# EAGLE board 4x16MUX_3 (EAGLE 6.5.0), part 1 of 2
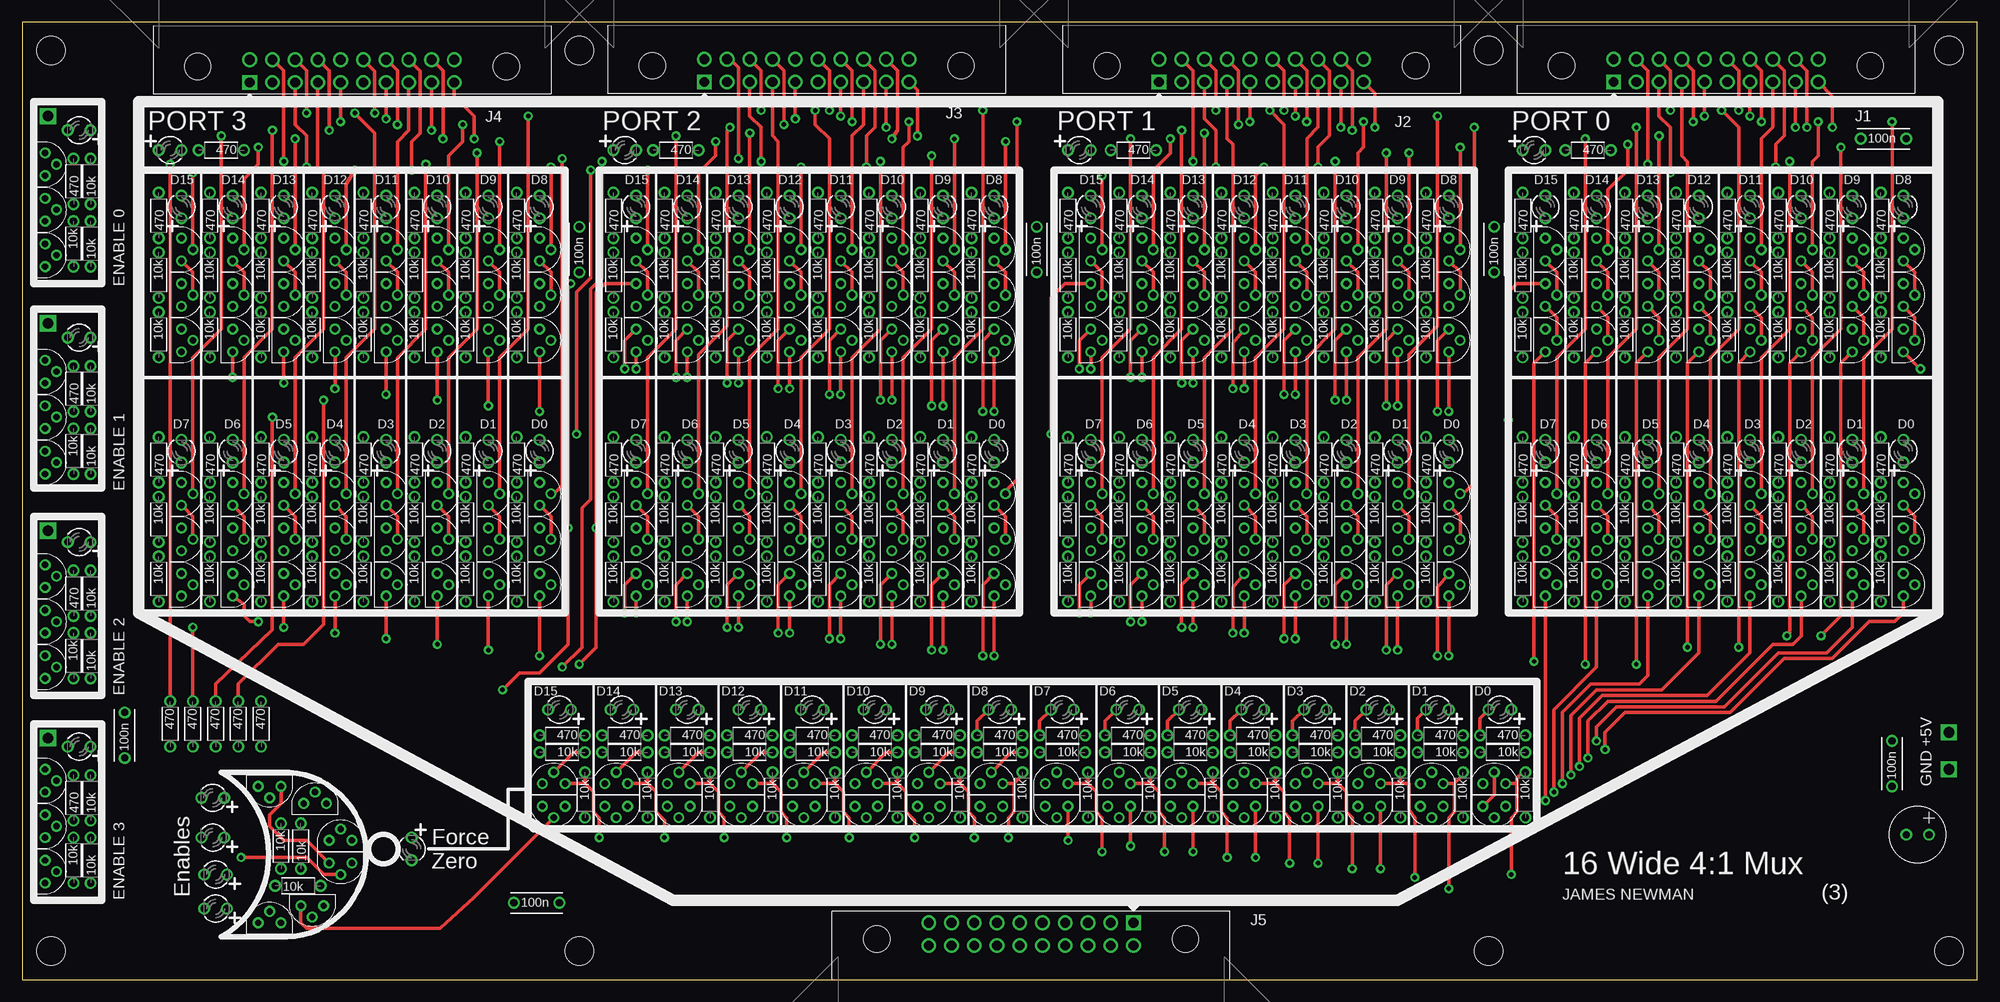
[diagram p14: board, top side]
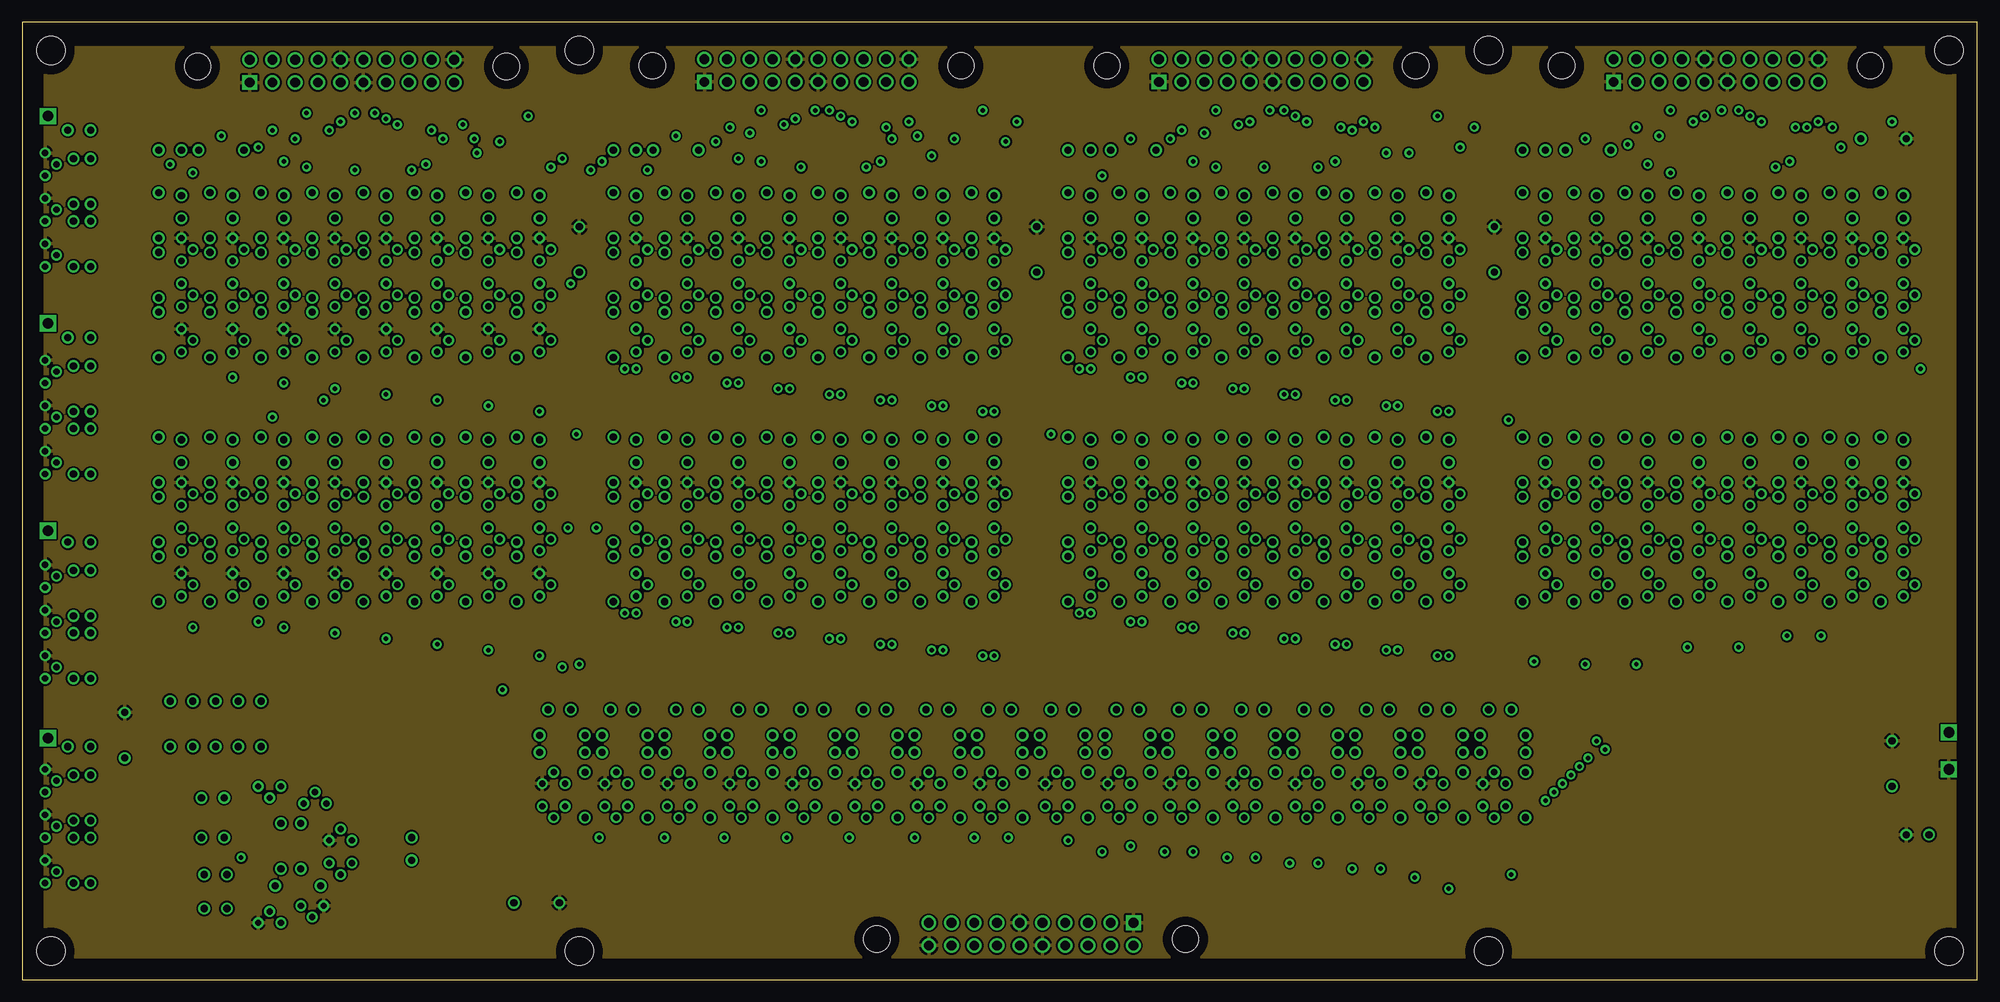
[diagram p15: board, inner layer Route2]
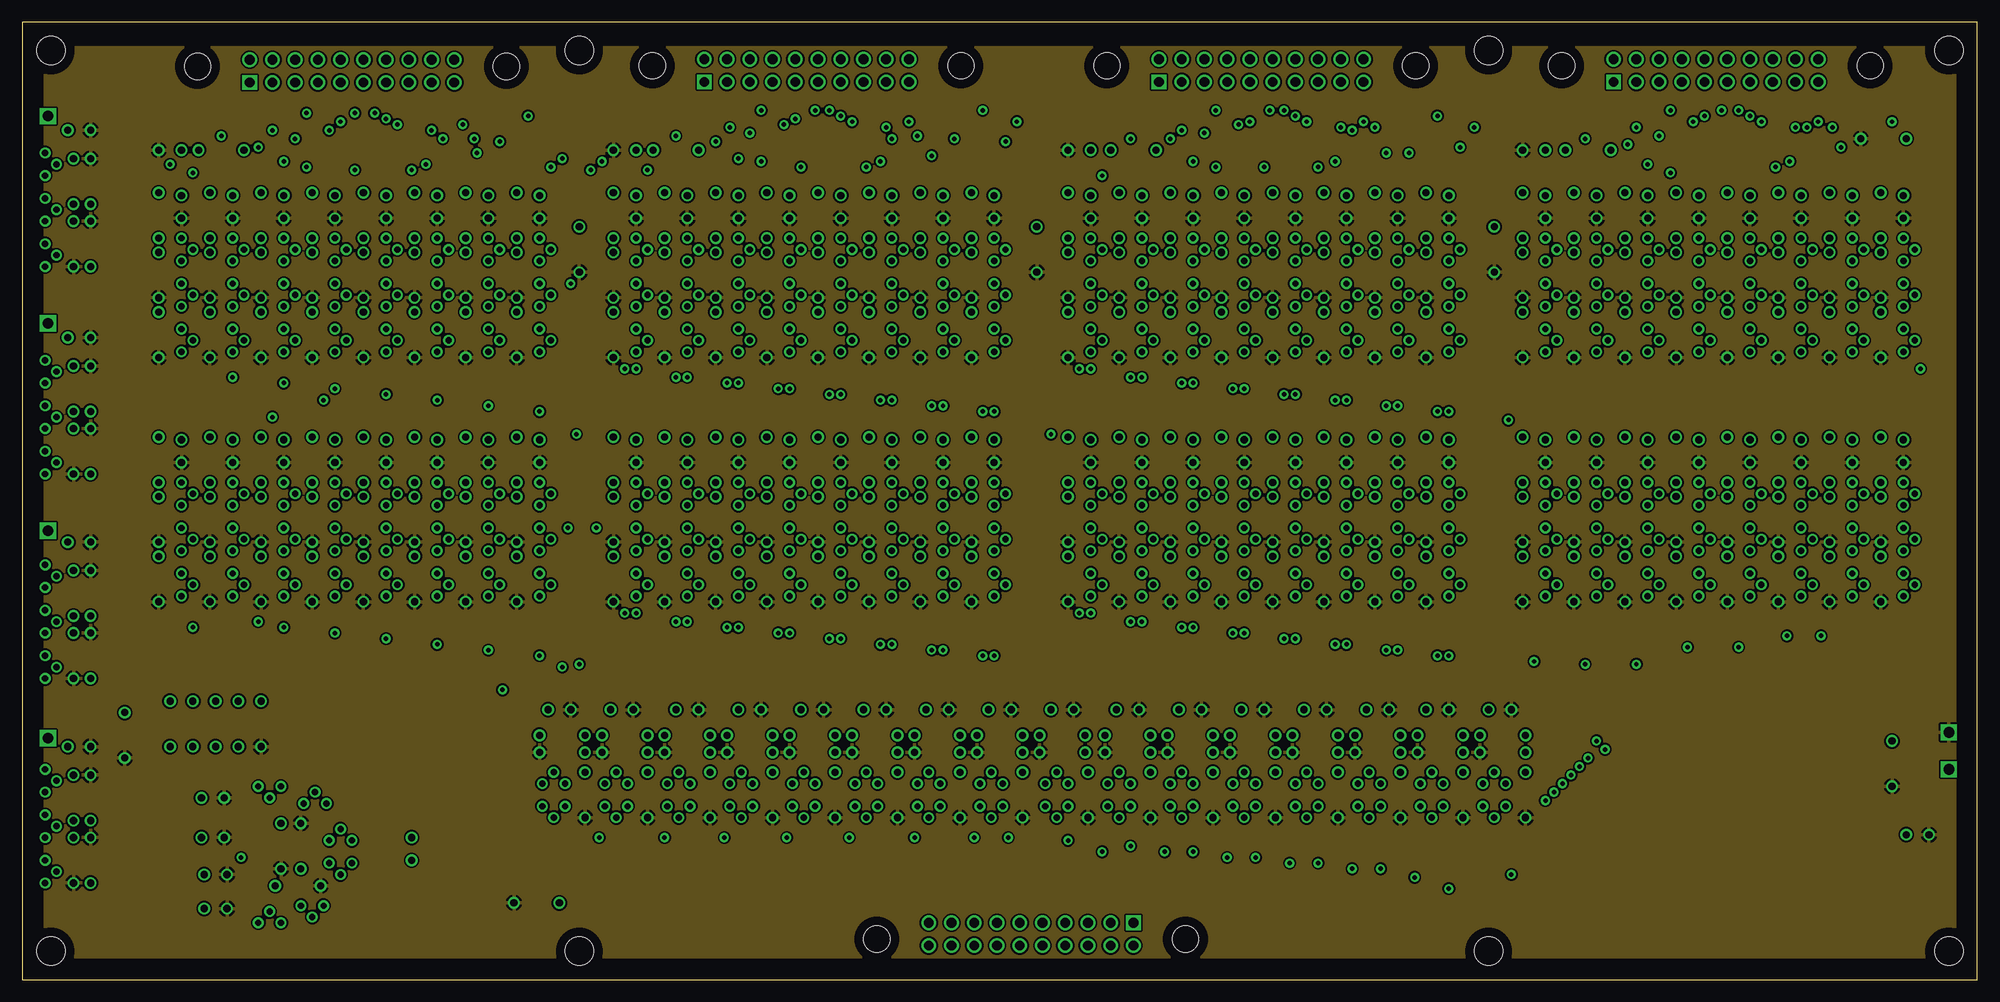
[diagram p16: board, inner layer Route3]
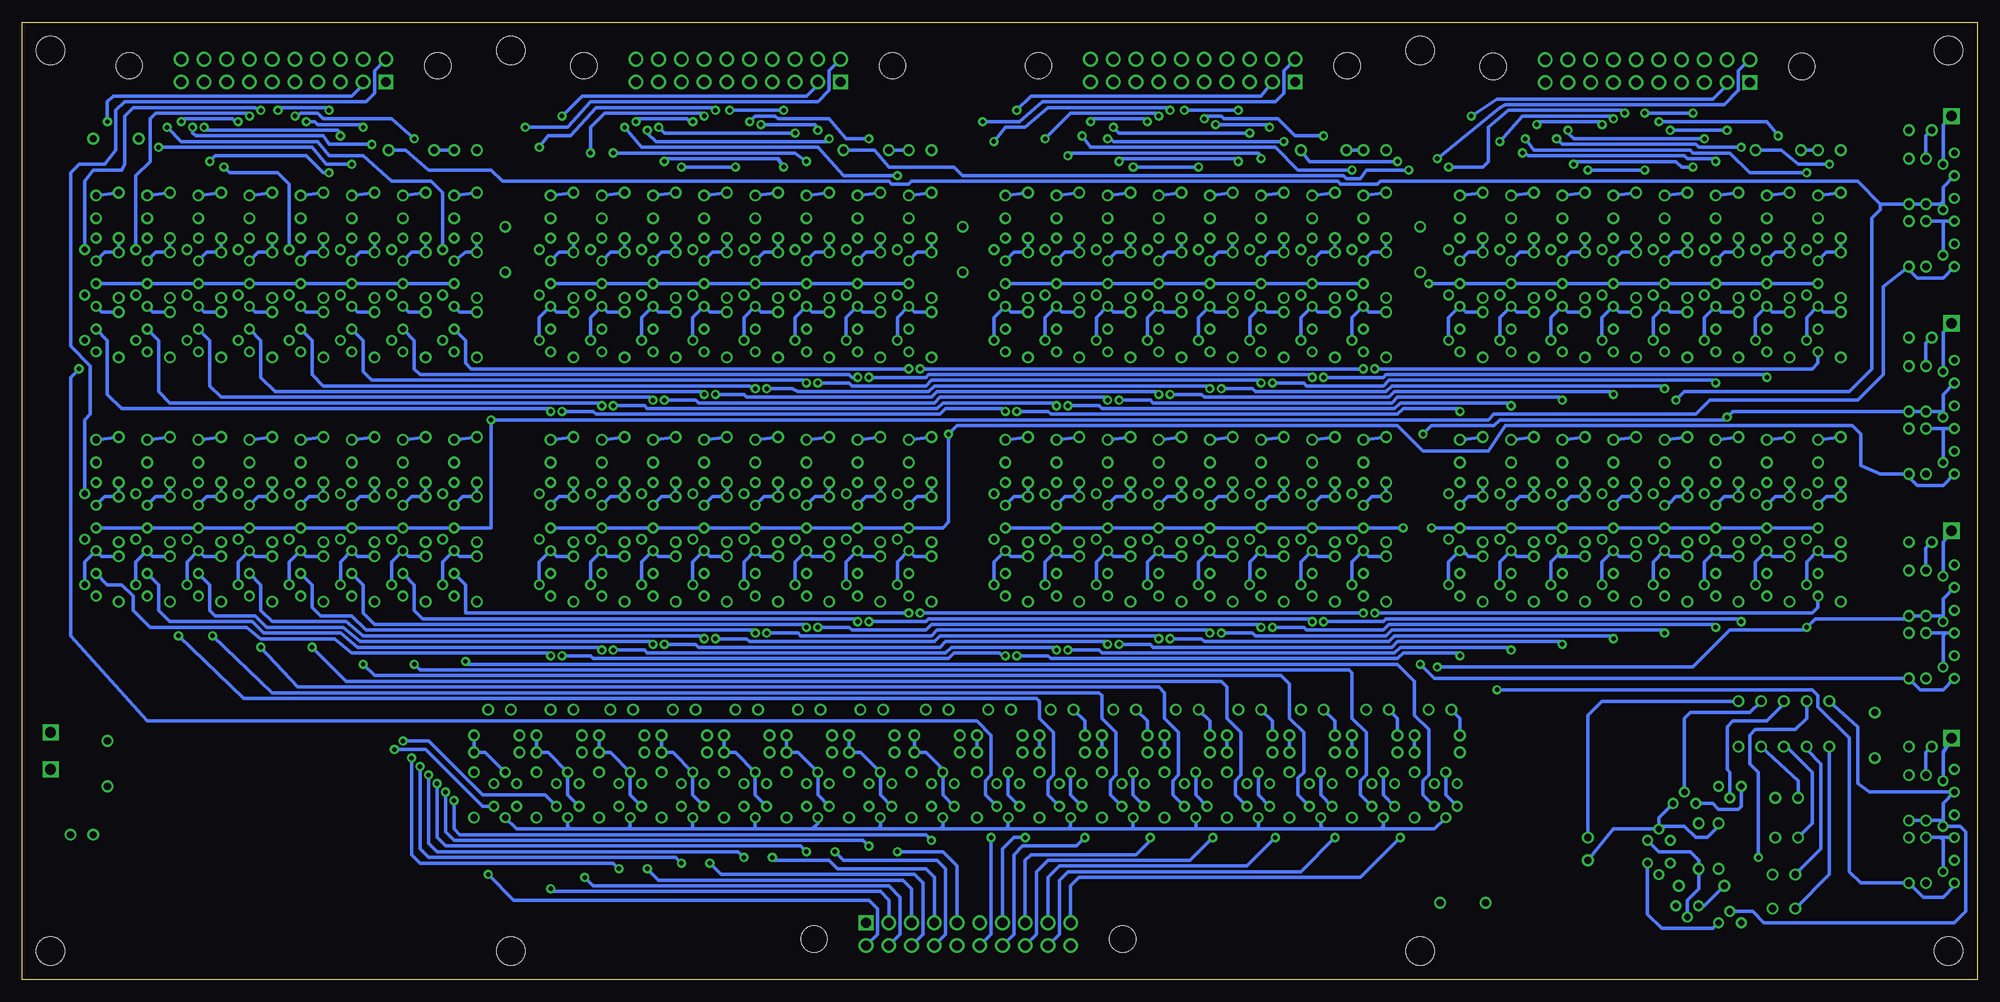
[diagram p17: board, bottom side, seen from below]

Size 218.42 x 106.98 mm. Coordinates in mm from the lower left corner, seen from the top.
Outline: 0,0 218.42,0 218.42,106.98 0,106.98 0,0
Copper layers (1*2+3*16): Top 0.035mm / dielectric 0.2mm / Route2 0.035mm / dielectric 1mm / Route3 0.035mm / dielectric 0.2mm / Bottom 0.035mm
Design rules "processor_rules_4layer": minimum track width 10mil, minimum drill 0.0236mm, track to track 8mil, track to pad 8mil, pad to pad 8mil, via to via 8mil, smd to smd 8mil, copper to edge 40mil, drill to drill 8mil, minimum pad ring 10mil, minimum via ring 8mil, stop-mask expansion 4mil, vias tented up to drill 0.7mm, thermal gap 10mil

## Footprints (pad centres in the part's own frame; a part is rotated, then mirrored left to right if it is on the bottom)
CAP_P2INCH = drill 0.8: 1 -2.54,0; 2 2.54,0
POLARISED_CAP_2P5_6P3MM = drill 0.8: A 1.27,0; K -1.27,0
LED3MM = drill 0.8: A -1.27,0; K 1.27,0
3M_HOLE = hole 3.2: 0,0
20_HDR_LOCKING_RA = drill 1.1 square: 1 -11.43,-1.27 | drill 1.1: 2 -11.43,1.27; 3 -8.89,-1.27; 4 -8.89,1.27; 5 -6.35,-1.27; 6 -6.35,1.27; 7 -3.81,-1.27; 8 -3.81,1.27; 9 -1.27,-1.27; 10 -1.27,1.27; 11 1.27,-1.27; 12 1.27,1.27; 13 3.81,-1.27; 14 3.81,1.27; 15 6.35,-1.27; 16 6.35,1.27; 17 8.89,-1.27; 18 8.89,1.27; 19 11.43,-1.27; 20 11.43,1.27 | hole 2.946: -17.247,0.533; 17.247,0.533
TO92-DGS = drill 0.7: D 0,1.27; G -1.27,0; S 0,-1.27
R_P2INCH = drill 0.8: 1 -2.54,0; 2 2.54,0
TEST_LOOP = drill 1.2 square: P$1 0,0

## Placement (x,y rotation side)
C1  100n  [CAP_P2INCH]  57.47,8.57 0 top
C2  100n  [CAP_P2INCH]  62.23,81.6 90 top
C3  100n  [CAP_P2INCH]  113.35,81.6 90 top
C4  100n  [CAP_P2INCH]  164.47,81.6 90 top
C5  100n  [CAP_P2INCH]  207.96,93.98 0 top
C6  100n  [CAP_P2INCH]  208.91,24.13 90 top
C7  100u  [POLARISED_CAP_2P5_6P3MM]  211.77,16.19 0 top
C8  100n  [CAP_P2INCH]  11.43,27.3 90 top
D1  L-1334SRT  [LED3MM]  210.19,59.05 90 top
D2  L-1334SRT  [LED3MM]  204.47,59.05 90 top
D3  L-1334SRT  [LED3MM]  198.75,59.05 90 top
D4  L-1334SRT  [LED3MM]  193.04,59.05 90 top
D5  L-1334SRT  [LED3MM]  187.32,59.05 90 top
D6  L-1334SRT  [LED3MM]  181.61,59.05 90 top
D7  L-1334SRT  [LED3MM]  175.9,59.05 90 top
D8  L-1334SRT  [LED3MM]  170.18,59.05 90 top
D9  L-1334SRT  [LED3MM]  210.19,86.36 90 top
D10  L-1334SRT  [LED3MM]  204.47,86.36 90 top
D11  L-1334SRT  [LED3MM]  198.75,86.36 90 top
D12  L-1334SRT  [LED3MM]  193.04,86.36 90 top
D13  L-1334SRT  [LED3MM]  187.32,86.36 90 top
D14  L-1334SRT  [LED3MM]  181.61,86.36 90 top
D15  L-1334SRT  [LED3MM]  175.9,86.36 90 top
D16  L-1334SRT  [LED3MM]  170.18,86.36 90 top
D17  L-1334SRT  [LED3MM]  159.38,59.05 90 top
D18  L-1334SRT  [LED3MM]  153.67,59.05 90 top
D19  L-1334SRT  [LED3MM]  147.96,59.05 90 top
D20  L-1334SRT  [LED3MM]  142.24,59.05 90 top
D21  L-1334SRT  [LED3MM]  136.53,59.05 90 top
D22  L-1334SRT  [LED3MM]  130.81,59.05 90 top
D23  L-1334SRT  [LED3MM]  125.09,59.05 90 top
D24  L-1334SRT  [LED3MM]  119.38,59.05 90 top
D25  L-1334SRT  [LED3MM]  159.38,86.36 90 top
D26  L-1334SRT  [LED3MM]  153.67,86.36 90 top
D27  L-1334SRT  [LED3MM]  147.96,86.36 90 top
D28  L-1334SRT  [LED3MM]  142.24,86.36 90 top
D29  L-1334SRT  [LED3MM]  136.53,86.36 90 top
D30  L-1334SRT  [LED3MM]  130.81,86.36 90 top
D31  L-1334SRT  [LED3MM]  125.09,86.36 90 top
D32  L-1334SRT  [LED3MM]  119.38,86.36 90 top
D33  L-1334SRT  [LED3MM]  108.58,59.05 90 top
D34  L-1334SRT  [LED3MM]  102.87,59.05 90 top
D35  L-1334SRT  [LED3MM]  97.16,59.05 90 top
D36  L-1334SRT  [LED3MM]  91.44,59.05 90 top
D37  L-1334SRT  [LED3MM]  85.72,59.05 90 top
D38  L-1334SRT  [LED3MM]  80.01,59.05 90 top
D39  L-1334SRT  [LED3MM]  74.3,59.05 90 top
D40  L-1334SRT  [LED3MM]  68.58,59.05 90 top
D41  L-1334SRT  [LED3MM]  108.58,86.36 90 top
D42  L-1334SRT  [LED3MM]  102.87,86.36 90 top
D43  L-1334SRT  [LED3MM]  97.16,86.36 90 top
D44  L-1334SRT  [LED3MM]  91.44,86.36 90 top
D45  L-1334SRT  [LED3MM]  85.72,86.36 90 top
D46  L-1334SRT  [LED3MM]  80.01,86.36 90 top
D47  L-1334SRT  [LED3MM]  74.3,86.36 90 top
D48  L-1334SRT  [LED3MM]  68.58,86.36 90 top
D49  L-1334SRT  [LED3MM]  57.78,59.05 90 top
D50  L-1334SRT  [LED3MM]  52.07,59.05 90 top
D51  L-1334SRT  [LED3MM]  46.35,59.05 90 top
D52  L-1334SRT  [LED3MM]  40.64,59.05 90 top
D53  L-1334SRT  [LED3MM]  34.92,59.05 90 top
D54  L-1334SRT  [LED3MM]  29.21,59.05 90 top
D55  L-1334SRT  [LED3MM]  23.5,59.05 90 top
D56  L-1334SRT  [LED3MM]  17.78,59.05 90 top
D57  L-1334SRT  [LED3MM]  57.78,86.36 90 top
D58  L-1334SRT  [LED3MM]  52.07,86.36 90 top
D59  L-1334SRT  [LED3MM]  46.35,86.36 90 top
D60  L-1334SRT  [LED3MM]  40.64,86.36 90 top
D61  L-1334SRT  [LED3MM]  34.92,86.36 90 top
D62  L-1334SRT  [LED3MM]  29.21,86.36 90 top
D63  L-1334SRT  [LED3MM]  23.5,86.36 90 top
D64  L-1334SRT  [LED3MM]  17.78,86.36 90 top
D65  L-1334SRT  [LED3MM]  6.35,94.93 180 top
D66  L-1334SRT  [LED3MM]  6.35,71.75 180 top
D67  L-1334SRT  [LED3MM]  6.35,48.9 180 top
D68  L-1334SRT  [LED3MM]  6.35,26.04 180 top
D69  L-1334SRT  [LED3MM]  165.1,30.16 180 top
D70  L-1334SRT  [LED3MM]  158.12,30.16 180 top
D71  L-1334SRT  [LED3MM]  151.45,30.16 180 top
D72  L-1334SRT  [LED3MM]  144.46,30.16 180 top
D73  L-1334SRT  [LED3MM]  137.48,30.16 180 top
D74  L-1334SRT  [LED3MM]  130.49,30.16 180 top
D75  L-1334SRT  [LED3MM]  123.51,30.16 180 top
D76  L-1334SRT  [LED3MM]  116.2,30.16 180 top
D77  L-1334SRT  [LED3MM]  109.22,30.16 180 top
D78  L-1334SRT  [LED3MM]  102.23,30.16 180 top
D79  L-1334SRT  [LED3MM]  95.25,30.16 180 top
D80  L-1334SRT  [LED3MM]  88.27,30.16 180 top
D81  L-1334SRT  [LED3MM]  81.28,30.16 180 top
D82  L-1334SRT  [LED3MM]  74.3,30.16 180 top
D83  L-1334SRT  [LED3MM]  66.99,30.16 180 top
D84  L-1334SRT  [LED3MM]  60.01,30.16 180 top
D85  L-1334SRT  [LED3MM]  168.91,92.71 0 top
D86  L-1334SRT  [LED3MM]  118.11,92.71 0 top
D87  L-1334SRT  [LED3MM]  67.31,92.71 0 top
D88  L-1334SRT  [LED3MM]  16.51,92.71 0 top
D89  L-1334SRT  [LED3MM]  21.27,20.32 180 top
D90  L-1334SRT  [LED3MM]  21.27,15.88 180 top
D91  L-1334SRT  [LED3MM]  21.59,11.75 180 top
D92  L-1334SRT  [LED3MM]  21.59,7.94 180 top
D93  L-1334SRT  [LED3MM]  43.5,14.61 270 top
H1  3M_MOUNT_HOLE  [3M_HOLE]  3.17,103.82 0 top
H2  3M_MOUNT_HOLE  [3M_HOLE]  3.17,3.17 0 top
H3  3M_MOUNT_HOLE  [3M_HOLE]  215.26,3.17 0 top
H4  3M_MOUNT_HOLE  [3M_HOLE]  215.26,103.82 0 top
H5  3M_MOUNT_HOLE  [3M_HOLE]  62.23,103.82 0 top
H6  3M_MOUNT_HOLE  [3M_HOLE]  163.83,103.82 0 top
H7  3M_MOUNT_HOLE  [3M_HOLE]  62.23,3.17 0 top
H8  3M_MOUNT_HOLE  [3M_HOLE]  163.83,3.17 0 top
J1  20_HDR_LOCKING_RA  [20_HDR_LOCKING_RA]  189.23,101.6 0 top
J2  20_HDR_LOCKING_RA  [20_HDR_LOCKING_RA]  138.43,101.6 0 top
J3  20_HDR_LOCKING_RA  [20_HDR_LOCKING_RA]  87.63,101.6 0 top
J4  20_HDR_LOCKING_RA  [20_HDR_LOCKING_RA]  36.83,101.54 0 top
J5  20_HDR_LOCKING_RA  [20_HDR_LOCKING_RA]  112.71,5.08 180 top
Q1  2N7000  [TO92-DGS]  210.19,54.29 180 top
Q2  2N7000  [TO92-DGS]  210.19,49.21 180 top
Q3  2N7000  [TO92-DGS]  204.47,54.29 180 top
Q4  2N7000  [TO92-DGS]  204.47,49.21 180 top
Q5  2N7000  [TO92-DGS]  198.75,54.29 180 top
Q6  2N7000  [TO92-DGS]  198.75,49.21 180 top
Q7  2N7000  [TO92-DGS]  193.04,54.29 180 top
Q8  2N7000  [TO92-DGS]  193.04,49.21 180 top
Q9  2N7000  [TO92-DGS]  187.32,54.29 180 top
Q10  2N7000  [TO92-DGS]  187.32,49.21 180 top
Q11  2N7000  [TO92-DGS]  181.61,54.29 180 top
Q12  2N7000  [TO92-DGS]  181.61,49.21 180 top
Q13  2N7000  [TO92-DGS]  175.9,54.29 180 top
Q14  2N7000  [TO92-DGS]  175.9,49.21 180 top
Q15  2N7000  [TO92-DGS]  170.18,54.29 180 top
Q16  2N7000  [TO92-DGS]  170.18,49.21 180 top
Q17  2N7000  [TO92-DGS]  210.19,81.6 180 top
Q18  2N7000  [TO92-DGS]  210.19,76.52 180 top
Q19  2N7000  [TO92-DGS]  204.47,81.6 180 top
Q20  2N7000  [TO92-DGS]  204.47,76.52 180 top
Q21  2N7000  [TO92-DGS]  198.75,81.6 180 top
Q22  2N7000  [TO92-DGS]  198.75,76.52 180 top
Q23  2N7000  [TO92-DGS]  193.04,81.6 180 top
Q24  2N7000  [TO92-DGS]  193.04,76.52 180 top
Q25  2N7000  [TO92-DGS]  187.32,81.6 180 top
Q26  2N7000  [TO92-DGS]  187.32,76.52 180 top
Q27  2N7000  [TO92-DGS]  181.61,81.6 180 top
Q28  2N7000  [TO92-DGS]  181.61,76.52 180 top
Q29  2N7000  [TO92-DGS]  175.9,81.6 180 top
Q30  2N7000  [TO92-DGS]  175.9,76.52 180 top
Q31  2N7000  [TO92-DGS]  170.18,81.6 180 top
Q32  2N7000  [TO92-DGS]  170.18,76.52 180 top
Q33  2N7000  [TO92-DGS]  159.38,54.29 180 top
Q34  2N7000  [TO92-DGS]  159.38,49.21 180 top
Q35  2N7000  [TO92-DGS]  153.67,54.29 180 top
Q36  2N7000  [TO92-DGS]  153.67,49.21 180 top
Q37  2N7000  [TO92-DGS]  147.96,54.29 180 top
Q38  2N7000  [TO92-DGS]  147.96,49.21 180 top
Q39  2N7000  [TO92-DGS]  142.24,54.29 180 top
Q40  2N7000  [TO92-DGS]  142.24,49.21 180 top
Q41  2N7000  [TO92-DGS]  136.53,54.29 180 top
Q42  2N7000  [TO92-DGS]  136.53,49.21 180 top
Q43  2N7000  [TO92-DGS]  130.81,54.29 180 top
Q44  2N7000  [TO92-DGS]  130.81,49.21 180 top
Q45  2N7000  [TO92-DGS]  125.09,54.29 180 top
Q46  2N7000  [TO92-DGS]  125.09,49.21 180 top
Q47  2N7000  [TO92-DGS]  119.38,54.29 180 top
Q48  2N7000  [TO92-DGS]  119.38,49.21 180 top
Q49  2N7000  [TO92-DGS]  159.38,81.6 180 top
Q50  2N7000  [TO92-DGS]  159.38,76.52 180 top
Q51  2N7000  [TO92-DGS]  153.67,81.6 180 top
Q52  2N7000  [TO92-DGS]  153.67,76.52 180 top
Q53  2N7000  [TO92-DGS]  147.96,81.6 180 top
Q54  2N7000  [TO92-DGS]  147.96,76.52 180 top
Q55  2N7000  [TO92-DGS]  142.24,81.6 180 top
Q56  2N7000  [TO92-DGS]  142.24,76.52 180 top
Q57  2N7000  [TO92-DGS]  136.53,81.6 180 top
Q58  2N7000  [TO92-DGS]  136.53,76.52 180 top
Q59  2N7000  [TO92-DGS]  130.81,81.6 180 top
Q60  2N7000  [TO92-DGS]  130.81,76.52 180 top
Q61  2N7000  [TO92-DGS]  125.09,81.6 180 top
Q62  2N7000  [TO92-DGS]  125.09,76.52 180 top
Q63  2N7000  [TO92-DGS]  119.38,81.6 180 top
Q64  2N7000  [TO92-DGS]  119.38,76.52 180 top
Q65  2N7000  [TO92-DGS]  108.58,54.29 180 top
Q66  2N7000  [TO92-DGS]  108.58,49.21 180 top
Q67  2N7000  [TO92-DGS]  102.87,54.29 180 top
Q68  2N7000  [TO92-DGS]  102.87,49.21 180 top
Q69  2N7000  [TO92-DGS]  97.16,54.29 180 top
Q70  2N7000  [TO92-DGS]  97.16,49.21 180 top
Q71  2N7000  [TO92-DGS]  91.44,54.29 180 top
Q72  2N7000  [TO92-DGS]  91.44,49.21 180 top
Q73  2N7000  [TO92-DGS]  85.72,54.29 180 top
Q74  2N7000  [TO92-DGS]  85.72,49.21 180 top
Q75  2N7000  [TO92-DGS]  80.01,54.29 180 top
Q76  2N7000  [TO92-DGS]  80.01,49.21 180 top
Q77  2N7000  [TO92-DGS]  74.3,54.29 180 top
Q78  2N7000  [TO92-DGS]  74.3,49.21 180 top
Q79  2N7000  [TO92-DGS]  68.58,54.29 180 top
Q80  2N7000  [TO92-DGS]  68.58,49.21 180 top
Q81  2N7000  [TO92-DGS]  108.58,81.6 180 top
Q82  2N7000  [TO92-DGS]  108.58,76.52 180 top
Q83  2N7000  [TO92-DGS]  102.87,81.6 180 top
Q84  2N7000  [TO92-DGS]  102.87,76.52 180 top
Q85  2N7000  [TO92-DGS]  97.16,81.6 180 top
Q86  2N7000  [TO92-DGS]  97.16,76.52 180 top
Q87  2N7000  [TO92-DGS]  91.44,81.6 180 top
Q88  2N7000  [TO92-DGS]  91.44,76.52 180 top
Q89  2N7000  [TO92-DGS]  85.72,81.6 180 top
Q90  2N7000  [TO92-DGS]  85.72,76.52 180 top
Q91  2N7000  [TO92-DGS]  80.01,81.6 180 top
Q92  2N7000  [TO92-DGS]  80.01,76.52 180 top
Q93  2N7000  [TO92-DGS]  74.3,81.6 180 top
Q94  2N7000  [TO92-DGS]  74.3,76.52 180 top
Q95  2N7000  [TO92-DGS]  68.58,81.6 180 top
Q96  2N7000  [TO92-DGS]  68.58,76.52 180 top
Q97  2N7000  [TO92-DGS]  57.78,54.29 180 top
Q98  2N7000  [TO92-DGS]  57.78,49.21 180 top
Q99  2N7000  [TO92-DGS]  52.07,54.29 180 top
Q100  2N7000  [TO92-DGS]  52.07,49.21 180 top
Q101  2N7000  [TO92-DGS]  46.35,54.29 180 top
Q102  2N7000  [TO92-DGS]  46.35,49.21 180 top
Q103  2N7000  [TO92-DGS]  40.64,54.29 180 top
Q104  2N7000  [TO92-DGS]  40.64,49.21 180 top
Q105  2N7000  [TO92-DGS]  34.92,54.29 180 top
Q106  2N7000  [TO92-DGS]  34.92,49.21 180 top
Q107  2N7000  [TO92-DGS]  29.21,54.29 180 top
Q108  2N7000  [TO92-DGS]  29.21,49.21 180 top
Q109  2N7000  [TO92-DGS]  23.5,54.29 180 top
Q110  2N7000  [TO92-DGS]  23.5,49.21 180 top
Q111  2N7000  [TO92-DGS]  17.78,54.29 180 top
Q112  2N7000  [TO92-DGS]  17.78,49.21 180 top
Q113  2N7000  [TO92-DGS]  57.78,81.6 180 top
Q114  2N7000  [TO92-DGS]  57.78,76.52 180 top
Q115  2N7000  [TO92-DGS]  52.07,81.6 180 top
Q116  2N7000  [TO92-DGS]  52.07,76.52 180 top
Q117  2N7000  [TO92-DGS]  46.35,81.6 180 top
Q118  2N7000  [TO92-DGS]  46.35,76.52 180 top
Q119  2N7000  [TO92-DGS]  40.64,81.6 180 top
Q120  2N7000  [TO92-DGS]  40.64,76.52 180 top
Q121  2N7000  [TO92-DGS]  34.92,81.6 180 top
Q122  2N7000  [TO92-DGS]  34.92,76.52 180 top
Q123  2N7000  [TO92-DGS]  29.21,81.6 180 top
Q124  2N7000  [TO92-DGS]  29.21,76.52 180 top
Q125  2N7000  [TO92-DGS]  23.5,81.6 180 top
Q126  2N7000  [TO92-DGS]  23.5,76.52 180 top
Q127  2N7000  [TO92-DGS]  17.78,81.6 180 top
Q128  2N7000  [TO92-DGS]  17.78,76.52 180 top
Q129  2N7000  [TO92-DGS]  2.54,91.12 180 top
Q130  2N7000  [TO92-DGS]  2.54,86.04 180 top
Q131  2N7000  [TO92-DGS]  2.54,80.96 180 top
Q132  2N7000  [TO92-DGS]  2.54,67.94 180 top
Q133  2N7000  [TO92-DGS]  2.54,62.87 180 top
Q134  2N7000  [TO92-DGS]  2.54,57.78 180 top
Q135  2N7000  [TO92-DGS]  2.54,45.09 180 top
Q136  2N7000  [TO92-DGS]  2.54,40.01 180 top
Q137  2N7000  [TO92-DGS]  2.54,34.92 180 top
Q138  2N7000  [TO92-DGS]  2.54,22.23 180 top
Q139  2N7000  [TO92-DGS]  2.54,17.14 180 top
Q140  2N7000  [TO92-DGS]  2.54,12.06 180 top
Q141  2N7000  [TO92-DGS]  210.19,44.13 180 top
Q142  2N7000  [TO92-DGS]  164.47,21.91 270 top
Q143  2N7000  [TO92-DGS]  159.38,44.13 180 top
Q144  2N7000  [TO92-DGS]  108.58,44.13 180 top
Q145  2N7000  [TO92-DGS]  57.78,44.13 180 top
Q146  2N7000  [TO92-DGS]  204.47,44.13 180 top
Q147  2N7000  [TO92-DGS]  157.48,21.91 270 top
Q148  2N7000  [TO92-DGS]  153.67,44.13 180 top
Q149  2N7000  [TO92-DGS]  102.87,44.13 180 top
Q150  2N7000  [TO92-DGS]  52.07,44.13 180 top
Q151  2N7000  [TO92-DGS]  198.75,44.13 180 top
Q152  2N7000  [TO92-DGS]  150.5,21.91 270 top
Q153  2N7000  [TO92-DGS]  147.96,44.13 180 top
Q154  2N7000  [TO92-DGS]  97.16,44.13 180 top
Q155  2N7000  [TO92-DGS]  46.35,44.13 180 top
Q156  2N7000  [TO92-DGS]  193.04,44.13 180 top
Q157  2N7000  [TO92-DGS]  143.51,21.91 270 top
Q158  2N7000  [TO92-DGS]  142.24,44.13 180 top
Q159  2N7000  [TO92-DGS]  91.44,44.13 180 top
Q160  2N7000  [TO92-DGS]  40.64,44.13 180 top
Q161  2N7000  [TO92-DGS]  187.32,44.13 180 top
Q162  2N7000  [TO92-DGS]  136.53,21.91 270 top
Q163  2N7000  [TO92-DGS]  136.53,44.13 180 top
Q164  2N7000  [TO92-DGS]  85.72,44.13 180 top
Q165  2N7000  [TO92-DGS]  34.92,44.13 180 top
Q166  2N7000  [TO92-DGS]  181.61,44.13 180 top
Q167  2N7000  [TO92-DGS]  129.54,21.91 270 top
Q168  2N7000  [TO92-DGS]  130.81,44.13 180 top
Q169  2N7000  [TO92-DGS]  80.01,44.13 180 top
Q170  2N7000  [TO92-DGS]  29.21,44.13 180 top
Q171  2N7000  [TO92-DGS]  175.9,44.13 180 top
Q172  2N7000  [TO92-DGS]  122.56,21.91 270 top
Q173  2N7000  [TO92-DGS]  125.09,44.13 180 top
Q174  2N7000  [TO92-DGS]  74.3,44.13 180 top
Q175  2N7000  [TO92-DGS]  23.5,44.13 180 top
Q176  2N7000  [TO92-DGS]  170.18,44.13 180 top
Q177  2N7000  [TO92-DGS]  115.57,21.91 270 top
Q178  2N7000  [TO92-DGS]  119.38,44.13 180 top
Q179  2N7000  [TO92-DGS]  68.58,44.13 180 top
Q180  2N7000  [TO92-DGS]  17.78,44.13 180 top
Q181  2N7000  [TO92-DGS]  210.19,71.44 180 top
Q182  2N7000  [TO92-DGS]  108.27,21.91 270 top
Q183  2N7000  [TO92-DGS]  159.38,71.44 180 top
Q184  2N7000  [TO92-DGS]  108.58,71.44 180 top
Q185  2N7000  [TO92-DGS]  57.78,71.44 180 top
Q186  2N7000  [TO92-DGS]  204.47,71.44 180 top
Q187  2N7000  [TO92-DGS]  101.28,21.91 270 top
Q188  2N7000  [TO92-DGS]  153.67,71.44 180 top
Q189  2N7000  [TO92-DGS]  102.87,71.44 180 top
Q190  2N7000  [TO92-DGS]  52.07,71.44 180 top
Q191  2N7000  [TO92-DGS]  198.75,71.44 180 top
Q192  2N7000  [TO92-DGS]  94.3,21.91 270 top
Q193  2N7000  [TO92-DGS]  147.96,71.44 180 top
Q194  2N7000  [TO92-DGS]  97.16,71.44 180 top
Q195  2N7000  [TO92-DGS]  46.35,71.44 180 top
Q196  2N7000  [TO92-DGS]  193.04,71.44 180 top
Q197  2N7000  [TO92-DGS]  87.31,21.91 270 top
Q198  2N7000  [TO92-DGS]  142.24,71.44 180 top
Q199  2N7000  [TO92-DGS]  91.44,71.44 180 top
Q200  2N7000  [TO92-DGS]  40.64,71.44 180 top
Q201  2N7000  [TO92-DGS]  187.32,71.44 180 top
Q202  2N7000  [TO92-DGS]  80.33,21.91 270 top
Q203  2N7000  [TO92-DGS]  136.53,71.44 180 top
Q204  2N7000  [TO92-DGS]  85.72,71.44 180 top
Q205  2N7000  [TO92-DGS]  34.92,71.44 180 top
Q206  2N7000  [TO92-DGS]  181.61,71.44 180 top
Q207  2N7000  [TO92-DGS]  73.34,21.91 270 top
Q208  2N7000  [TO92-DGS]  130.81,71.44 180 top
Q209  2N7000  [TO92-DGS]  80.01,71.44 180 top
Q210  2N7000  [TO92-DGS]  29.21,71.44 180 top
Q211  2N7000  [TO92-DGS]  175.9,71.44 180 top
Q212  2N7000  [TO92-DGS]  66.36,21.91 270 top
Q213  2N7000  [TO92-DGS]  125.09,71.44 180 top
Q214  2N7000  [TO92-DGS]  74.3,71.44 180 top
Q215  2N7000  [TO92-DGS]  23.5,71.44 180 top
Q216  2N7000  [TO92-DGS]  170.18,71.44 180 top
Q217  2N7000  [TO92-DGS]  59.37,21.91 270 top
Q218  2N7000  [TO92-DGS]  119.38,71.44 180 top
Q219  2N7000  [TO92-DGS]  68.58,71.44 180 top
Q220  2N7000  [TO92-DGS]  17.78,71.44 180 top
Q221  2N7000  [TO92-DGS]  164.47,19.37 90 top
Q222  2N7000  [TO92-DGS]  157.48,19.37 90 top
Q223  2N7000  [TO92-DGS]  150.5,19.37 90 top
Q224  2N7000  [TO92-DGS]  143.51,19.37 90 top
Q225  2N7000  [TO92-DGS]  136.53,19.37 90 top
Q226  2N7000  [TO92-DGS]  129.54,19.37 90 top
Q227  2N7000  [TO92-DGS]  122.56,19.37 90 top
Q228  2N7000  [TO92-DGS]  115.57,19.37 90 top
Q229  2N7000  [TO92-DGS]  108.27,19.37 90 top
Q230  2N7000  [TO92-DGS]  101.28,19.37 90 top
Q231  2N7000  [TO92-DGS]  94.3,19.37 90 top
Q232  2N7000  [TO92-DGS]  87.31,19.37 90 top
Q233  2N7000  [TO92-DGS]  80.33,19.37 90 top
Q234  2N7000  [TO92-DGS]  73.34,19.37 90 top
Q235  2N7000  [TO92-DGS]  66.36,19.37 90 top
Q236  2N7000  [TO92-DGS]  59.37,19.37 90 top
Q237  2N7000  [TO92-DGS]  27.62,6.35 270 top
Q238  2N7000  [TO92-DGS]  32.7,19.68 270 top
Q239  2N7000  [TO92-DGS]  27.62,21.59 90 top
Q240  2N7000  [TO92-DGS]  35.56,13.02 90 top
Q241  2N7000  [TO92-DGS]  35.56,15.56 270 top
Q242  2N7000  [TO92-DGS]  32.38,8.26 90 top
R1  10k  [R_P2INCH]  207.65,51.44 270 top
R2  470  [R_P2INCH]  207.65,58.1 90 top
R3  10k  [R_P2INCH]  201.93,51.44 270 top
R4  470  [R_P2INCH]  201.93,58.1 90 top
R5  10k  [R_P2INCH]  196.22,51.44 270 top
R6  470  [R_P2INCH]  196.22,58.1 90 top
R7  10k  [R_P2INCH]  190.5,51.44 270 top
R8  470  [R_P2INCH]  190.5,58.1 90 top
R9  10k  [R_P2INCH]  184.78,51.44 270 top
R10  470  [R_P2INCH]  184.78,58.1 90 top
R11  10k  [R_P2INCH]  179.07,51.44 270 top
R12  470  [R_P2INCH]  179.07,58.1 90 top
R13  10k  [R_P2INCH]  173.35,51.44 270 top
R14  470  [R_P2INCH]  173.35,58.1 90 top
R15  10k  [R_P2INCH]  167.64,51.44 270 top
R16  470  [R_P2INCH]  167.64,58.1 90 top
R17  10k  [R_P2INCH]  207.65,78.74 270 top
R18  470  [R_P2INCH]  207.65,85.41 90 top
R19  10k  [R_P2INCH]  201.93,78.74 270 top
R20  470  [R_P2INCH]  201.93,85.41 90 top
R21  10k  [R_P2INCH]  196.22,78.74 270 top
R22  470  [R_P2INCH]  196.22,85.41 90 top
R23  10k  [R_P2INCH]  190.5,78.74 270 top
R24  470  [R_P2INCH]  190.5,85.41 90 top
R25  10k  [R_P2INCH]  184.78,78.74 270 top
R26  470  [R_P2INCH]  184.78,85.41 90 top
R27  10k  [R_P2INCH]  179.07,78.74 270 top
R28  470  [R_P2INCH]  179.07,85.41 90 top
R29  10k  [R_P2INCH]  173.35,78.74 270 top
R30  470  [R_P2INCH]  173.35,85.41 90 top
R31  10k  [R_P2INCH]  167.64,78.74 270 top
R32  470  [R_P2INCH]  167.64,85.41 90 top
R33  10k  [R_P2INCH]  156.84,51.44 270 top
R34  470  [R_P2INCH]  156.84,58.1 90 top
R35  10k  [R_P2INCH]  151.13,51.44 270 top
R36  470  [R_P2INCH]  151.13,58.1 90 top
R37  10k  [R_P2INCH]  145.41,51.44 270 top
R38  470  [R_P2INCH]  145.41,58.1 90 top
R39  10k  [R_P2INCH]  139.7,51.44 270 top
R40  470  [R_P2INCH]  139.7,58.1 90 top
R41  10k  [R_P2INCH]  133.99,51.44 270 top
R42  470  [R_P2INCH]  133.99,58.1 90 top
R43  10k  [R_P2INCH]  128.27,51.44 270 top
R44  470  [R_P2INCH]  128.27,58.1 90 top
R45  10k  [R_P2INCH]  122.56,51.44 270 top
R46  470  [R_P2INCH]  122.56,58.1 90 top
R47  10k  [R_P2INCH]  116.84,51.44 270 top
R48  470  [R_P2INCH]  116.84,58.1 90 top
R49  10k  [R_P2INCH]  156.84,78.74 270 top
R50  470  [R_P2INCH]  156.84,85.41 90 top
R51  10k  [R_P2INCH]  151.13,78.74 270 top
R52  470  [R_P2INCH]  151.13,85.41 90 top
R53  10k  [R_P2INCH]  145.41,78.74 270 top
R54  470  [R_P2INCH]  145.41,85.41 90 top
R55  10k  [R_P2INCH]  139.7,78.74 270 top
R56  470  [R_P2INCH]  139.7,85.41 90 top
R57  10k  [R_P2INCH]  133.99,78.74 270 top
R58  470  [R_P2INCH]  133.99,85.41 90 top
R59  10k  [R_P2INCH]  128.27,78.74 270 top
R60  470  [R_P2INCH]  128.27,85.41 90 top
R61  10k  [R_P2INCH]  122.56,78.74 270 top
R62  470  [R_P2INCH]  122.56,85.41 90 top
R63  10k  [R_P2INCH]  116.84,78.74 270 top
R64  470  [R_P2INCH]  116.84,85.41 90 top
R65  10k  [R_P2INCH]  106.05,51.44 270 top
R66  470  [R_P2INCH]  106.05,58.1 90 top
R67  10k  [R_P2INCH]  100.33,51.44 270 top
R68  470  [R_P2INCH]  100.33,58.1 90 top
R69  10k  [R_P2INCH]  94.61,51.44 270 top
R70  470  [R_P2INCH]  94.61,58.1 90 top
R71  10k  [R_P2INCH]  88.9,51.44 270 top
R72  470  [R_P2INCH]  88.9,58.1 90 top
R73  10k  [R_P2INCH]  83.19,51.44 270 top
R74  470  [R_P2INCH]  83.19,58.1 90 top
R75  10k  [R_P2INCH]  77.47,51.44 270 top
R76  470  [R_P2INCH]  77.47,58.1 90 top
R77  10k  [R_P2INCH]  71.75,51.44 270 top
R78  470  [R_P2INCH]  71.75,58.1 90 top
R79  10k  [R_P2INCH]  66.04,51.44 270 top
R80  470  [R_P2INCH]  66.04,58.1 90 top
R81  10k  [R_P2INCH]  106.05,78.74 270 top
R82  470  [R_P2INCH]  106.05,85.41 90 top
R83  10k  [R_P2INCH]  100.33,78.74 270 top
R84  470  [R_P2INCH]  100.33,85.41 90 top
R85  10k  [R_P2INCH]  94.61,78.74 270 top
R86  470  [R_P2INCH]  94.61,85.41 90 top
R87  10k  [R_P2INCH]  88.9,78.74 270 top
R88  470  [R_P2INCH]  88.9,85.41 90 top
R89  10k  [R_P2INCH]  83.19,78.74 270 top
R90  470  [R_P2INCH]  83.19,85.41 90 top
R91  10k  [R_P2INCH]  77.47,78.74 270 top
R92  470  [R_P2INCH]  77.47,85.41 90 top
R93  10k  [R_P2INCH]  71.75,78.74 270 top
R94  470  [R_P2INCH]  71.75,85.41 90 top
R95  10k  [R_P2INCH]  66.04,78.74 270 top
R96  470  [R_P2INCH]  66.04,85.41 90 top
R97  10k  [R_P2INCH]  55.24,51.44 270 top
R98  470  [R_P2INCH]  55.24,58.1 90 top
R99  10k  [R_P2INCH]  49.53,51.44 270 top
R100  470  [R_P2INCH]  49.53,58.1 90 top
R101  10k  [R_P2INCH]  43.81,51.44 270 top
R102  470  [R_P2INCH]  43.81,58.1 90 top
R103  10k  [R_P2INCH]  38.1,51.44 270 top
R104  470  [R_P2INCH]  38.1,58.1 90 top
R105  10k  [R_P2INCH]  32.38,51.44 270 top
R106  470  [R_P2INCH]  32.38,58.1 90 top
R107  10k  [R_P2INCH]  26.67,51.44 270 top
R108  470  [R_P2INCH]  26.67,58.1 90 top
R109  10k  [R_P2INCH]  20.95,51.44 270 top
R110  470  [R_P2INCH]  20.95,58.1 90 top
R111  10k  [R_P2INCH]  15.24,51.44 270 top
R112  470  [R_P2INCH]  15.24,58.1 90 top
R113  10k  [R_P2INCH]  55.24,78.74 270 top
R114  470  [R_P2INCH]  55.24,85.41 90 top
R115  10k  [R_P2INCH]  49.53,78.74 270 top
R116  470  [R_P2INCH]  49.53,85.41 90 top
R117  10k  [R_P2INCH]  43.81,78.74 270 top
R118  470  [R_P2INCH]  43.81,85.41 90 top
R119  10k  [R_P2INCH]  38.1,78.74 270 top
R120  470  [R_P2INCH]  38.1,85.41 90 top
R121  10k  [R_P2INCH]  32.38,78.74 270 top
R122  470  [R_P2INCH]  32.38,85.41 90 top
R123  10k  [R_P2INCH]  26.67,78.74 270 top
R124  470  [R_P2INCH]  26.67,85.41 90 top
R125  10k  [R_P2INCH]  20.95,78.74 270 top
R126  470  [R_P2INCH]  20.95,85.41 90 top
R127  10k  [R_P2INCH]  15.24,78.74 270 top
R128  470  [R_P2INCH]  15.24,85.41 90 top
R129  10k  [R_P2INCH]  7.62,89.22 90 top
R130  470  [R_P2INCH]  5.71,89.22 90 top
R131  10k  [R_P2INCH]  5.71,82.23 270 top
R132  10k  [R_P2INCH]  7.62,82.23 90 top
R133  10k  [R_P2INCH]  7.62,66.04 90 top
R134  470  [R_P2INCH]  5.71,66.04 90 top
R135  10k  [R_P2INCH]  5.71,59.05 270 top
R136  10k  [R_P2INCH]  7.62,59.05 90 top
R137  10k  [R_P2INCH]  7.62,43.18 90 top
R138  470  [R_P2INCH]  5.71,43.18 90 top
R139  10k  [R_P2INCH]  5.71,36.2 270 top
R140  10k  [R_P2INCH]  7.62,36.2 90 top
R141  10k  [R_P2INCH]  7.62,20.32 90 top
R142  470  [R_P2INCH]  5.71,20.32 90 top
R143  10k  [R_P2INCH]  5.71,13.34 270 top
R144  10k  [R_P2INCH]  7.62,13.34 90 top
R145  10k  [R_P2INCH]  165.42,25.4 180 top
R146  470  [R_P2INCH]  165.42,27.3 180 top
R147  10k  [R_P2INCH]  158.43,25.4 180 top
R148  470  [R_P2INCH]  158.43,27.3 180 top
R149  10k  [R_P2INCH]  151.45,25.4 180 top
R150  470  [R_P2INCH]  151.45,27.3 180 top
R151  10k  [R_P2INCH]  144.46,25.4 180 top
R152  470  [R_P2INCH]  144.46,27.3 180 top
R153  10k  [R_P2INCH]  137.48,25.4 180 top
R154  470  [R_P2INCH]  137.48,27.3 180 top
R155  10k  [R_P2INCH]  130.49,25.4 180 top
R156  470  [R_P2INCH]  130.49,27.3 180 top
R157  10k  [R_P2INCH]  123.51,25.4 180 top
R158  470  [R_P2INCH]  123.51,27.3 180 top
R159  10k  [R_P2INCH]  116.2,25.4 180 top
R160  470  [R_P2INCH]  116.2,27.3 180 top
R161  10k  [R_P2INCH]  109.22,25.4 180 top
R162  470  [R_P2INCH]  109.22,27.3 180 top
R163  10k  [R_P2INCH]  102.23,25.4 180 top
R164  470  [R_P2INCH]  102.23,27.3 180 top
R165  10k  [R_P2INCH]  95.25,25.4 180 top
R166  470  [R_P2INCH]  95.25,27.3 180 top
R167  10k  [R_P2INCH]  88.27,25.4 180 top
R168  470  [R_P2INCH]  88.27,27.3 180 top
R169  10k  [R_P2INCH]  81.28,25.4 180 top
R170  470  [R_P2INCH]  81.28,27.3 180 top
R171  10k  [R_P2INCH]  74.3,25.4 180 top
R172  470  [R_P2INCH]  74.3,27.3 180 top
R173  10k  [R_P2INCH]  67.31,25.4 180 top
R174  470  [R_P2INCH]  67.31,27.3 180 top
R175  10k  [R_P2INCH]  60.33,25.4 180 top
R176  470  [R_P2INCH]  60.33,27.3 180 top
R177  470  [R_P2INCH]  174.94,92.71 180 top
R178  470  [R_P2INCH]  124.14,92.71 180 top
R179  470  [R_P2INCH]  73.03,92.71 180 top
R180  470  [R_P2INCH]  22.23,92.71 180 top
R181  10k  [R_P2INCH]  207.65,44.77 270 top
R182  10k  [R_P2INCH]  201.93,44.77 270 top
R183  10k  [R_P2INCH]  196.22,44.77 270 top
R184  10k  [R_P2INCH]  190.5,44.77 270 top
R185  10k  [R_P2INCH]  184.78,44.77 270 top
R186  10k  [R_P2INCH]  179.07,44.77 270 top
R187  10k  [R_P2INCH]  173.35,44.77 270 top
R188  10k  [R_P2INCH]  167.64,44.77 270 top
R189  10k  [R_P2INCH]  207.65,72.07 270 top
R190  10k  [R_P2INCH]  201.93,72.07 270 top
R191  10k  [R_P2INCH]  196.22,72.07 270 top
R192  10k  [R_P2INCH]  190.5,72.07 270 top
R193  10k  [R_P2INCH]  184.78,72.07 270 top
R194  10k  [R_P2INCH]  179.07,72.07 270 top
R195  10k  [R_P2INCH]  173.35,72.07 270 top
R196  10k  [R_P2INCH]  167.64,72.07 270 top
R197  10k  [R_P2INCH]  156.84,44.77 270 top
R198  10k  [R_P2INCH]  151.13,44.77 270 top
R199  10k  [R_P2INCH]  145.41,44.77 270 top
R200  10k  [R_P2INCH]  139.7,44.77 270 top
R201  10k  [R_P2INCH]  133.99,44.77 270 top
R202  10k  [R_P2INCH]  128.27,44.77 270 top
R203  10k  [R_P2INCH]  122.56,44.77 270 top
R204  10k  [R_P2INCH]  116.84,44.77 270 top
R205  10k  [R_P2INCH]  156.84,72.07 270 top
R206  10k  [R_P2INCH]  151.13,72.07 270 top
R207  10k  [R_P2INCH]  145.41,72.07 270 top
R208  10k  [R_P2INCH]  139.7,72.07 270 top
R209  10k  [R_P2INCH]  133.99,72.07 270 top
R210  10k  [R_P2INCH]  128.27,72.07 270 top
R211  10k  [R_P2INCH]  122.56,72.07 270 top
R212  10k  [R_P2INCH]  116.84,72.07 270 top
R213  10k  [R_P2INCH]  106.05,44.77 270 top
R214  10k  [R_P2INCH]  100.33,44.77 270 top
R215  10k  [R_P2INCH]  94.61,44.77 270 top
R216  10k  [R_P2INCH]  88.9,44.77 270 top
R217  10k  [R_P2INCH]  83.19,44.77 270 top
R218  10k  [R_P2INCH]  77.47,44.77 270 top
R219  10k  [R_P2INCH]  71.75,44.77 270 top
R220  10k  [R_P2INCH]  66.04,44.77 270 top
R221  10k  [R_P2INCH]  106.05,72.07 270 top
R222  10k  [R_P2INCH]  100.33,72.07 270 top
R223  10k  [R_P2INCH]  94.61,72.07 270 top
R224  10k  [R_P2INCH]  88.9,72.07 270 top
R225  10k  [R_P2INCH]  83.19,72.07 270 top
R226  10k  [R_P2INCH]  77.47,72.07 270 top
R227  10k  [R_P2INCH]  71.75,72.07 270 top
R228  10k  [R_P2INCH]  66.04,72.07 270 top
R229  10k  [R_P2INCH]  55.24,44.77 270 top
R230  10k  [R_P2INCH]  49.53,44.77 270 top
R231  10k  [R_P2INCH]  43.81,44.77 270 top
R232  10k  [R_P2INCH]  38.1,44.77 270 top
R233  10k  [R_P2INCH]  32.38,44.77 270 top
R234  10k  [R_P2INCH]  26.67,44.77 270 top
R235  10k  [R_P2INCH]  20.95,44.77 270 top
R236  10k  [R_P2INCH]  15.24,44.77 270 top
R237  10k  [R_P2INCH]  55.24,72.07 270 top
R238  10k  [R_P2INCH]  49.53,72.07 270 top
R239  10k  [R_P2INCH]  43.81,72.07 270 top
R240  10k  [R_P2INCH]  38.1,72.07 270 top
R241  10k  [R_P2INCH]  32.38,72.07 270 top
R242  10k  [R_P2INCH]  26.67,72.07 270 top
R243  10k  [R_P2INCH]  20.95,72.07 270 top
R244  10k  [R_P2INCH]  15.24,72.07 270 top
R245  10k  [R_P2INCH]  28.89,14.92 270 top
R246  470  [R_P2INCH]  24.13,28.57 270 top
R247  470  [R_P2INCH]  21.59,28.57 270 top
R248  470  [R_P2INCH]  19.05,28.57 270 top
R249  470  [R_P2INCH]  16.51,28.57 270 top
R250  10k  [R_P2INCH]  167.96,20.64 270 top
R251  470  [R_P2INCH]  26.67,28.57 270 top
R252  10k  [R_P2INCH]  31.11,14.92 90 top
R253  10k  [R_P2INCH]  160.97,20.64 270 top
R254  10k  [R_P2INCH]  153.99,20.64 270 top
R255  10k  [R_P2INCH]  147,20.64 270 top
R256  10k  [R_P2INCH]  140.02,20.64 270 top
R257  10k  [R_P2INCH]  133.03,20.64 270 top
R258  10k  [R_P2INCH]  126.05,20.64 270 top
R259  10k  [R_P2INCH]  119.06,20.64 270 top
R260  10k  [R_P2INCH]  111.76,20.64 270 top
R261  10k  [R_P2INCH]  104.78,20.64 270 top
R262  10k  [R_P2INCH]  97.79,20.64 270 top
R263  10k  [R_P2INCH]  90.81,20.64 270 top
R264  10k  [R_P2INCH]  83.82,20.64 270 top
R265  10k  [R_P2INCH]  76.83,20.64 270 top
R266  10k  [R_P2INCH]  69.85,20.64 270 top
R267  10k  [R_P2INCH]  62.87,20.64 270 top
R268  10k  [R_P2INCH]  30.8,10.48 0 top
TP1  [TEST_LOOP]  2.86,96.52 90 top
TP2  [TEST_LOOP]  2.86,73.34 90 top
TP3  [TEST_LOOP]  2.86,50.16 90 top
TP4  [TEST_LOOP]  2.86,26.99 90 top
TP5  [TEST_LOOP]  215.26,27.62 0 top
TP6  [TEST_LOOP]  215.26,23.5 0 top